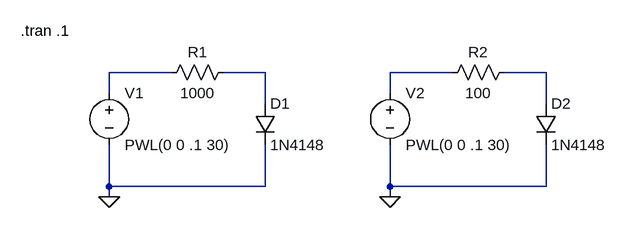
[diagram p0: schematic Diodo - CurvadoDiodo.asc]
Diodo - CurvadoDiodo.asc, the LTspice schematic file:
Version 4
SHEET 1 880 680
WIRE 128 96 32 96
WIRE 272 96 208 96
WIRE 560 96 464 96
WIRE 704 96 640 96
WIRE 32 128 32 96
WIRE 464 128 464 96
WIRE 272 144 272 96
WIRE 704 144 704 96
WIRE 32 272 32 208
WIRE 272 272 272 208
WIRE 272 272 32 272
WIRE 464 272 464 208
WIRE 704 272 704 208
WIRE 704 272 464 272
WIRE 32 288 32 272
WIRE 464 288 464 272
FLAG 32 288 0
FLAG 464 288 0
SYMBOL voltage 32 112 R0
WINDOW 123 0 0 Left 2
WINDOW 39 0 0 Left 2
SYMATTR InstName V1
SYMATTR Value PWL(0 0 .1 30)
SYMBOL res 224 80 R90
WINDOW 0 0 56 VBottom 2
WINDOW 3 32 56 VTop 2
SYMATTR InstName R1
SYMATTR Value 1000
SYMBOL diode 256 144 R0
SYMATTR InstName D1
SYMATTR Value 1N4148
SYMBOL voltage 464 112 R0
WINDOW 123 0 0 Left 2
WINDOW 39 0 0 Left 2
SYMATTR InstName V2
SYMATTR Value PWL(0 0 .1 30)
SYMBOL res 656 80 R90
WINDOW 0 0 56 VBottom 2
WINDOW 3 32 56 VTop 2
SYMATTR InstName R2
SYMATTR Value 100
SYMBOL diode 688 144 R0
SYMATTR InstName D2
SYMATTR Value 1N4148
TEXT -104 32 Left 2 !.tran .1

The netlist it stands for:
* Diodo - CurvadoDiodo.asc
V1 N001 0 PWL(0 0 .1 30)
R1 N002 N001 1000
D1 N002 0 1N4148
V2 N003 0 PWL(0 0 .1 30)
R2 N004 N003 100
D2 N004 0 1N4148
.model D D
.lib standard.dio
.tran .1
.backanno
.end